# Altium schematic sheet LORA.SchDoc
size A4
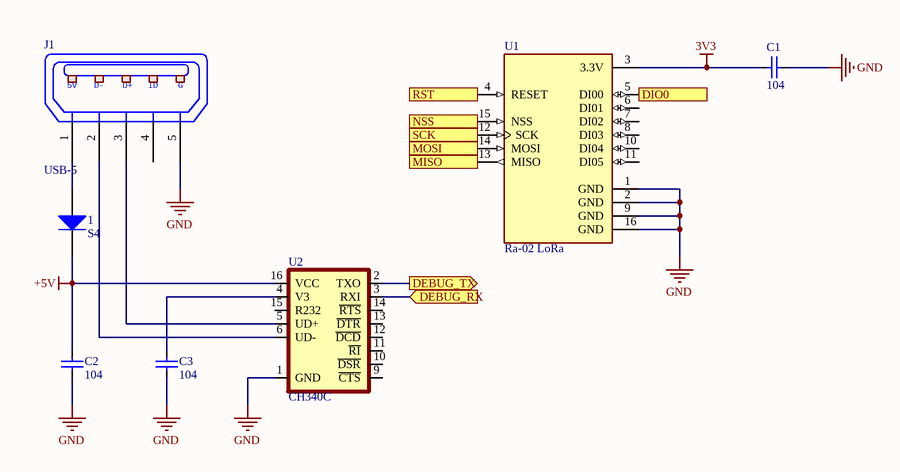
[diagram p0: LORA.SchDoc]

## Parts
1  S4  [DIO-214AC(SMA)]
C1  104  [CAP_0805]
C2  104  [CAP_0805]
C3  104  [CAP_0805]
J1  USB-5  [USB-M1]
U1  Ra-02 LoRa  [Ra-02]
U2  CH340C  [SOP-16]

## Ports
DEBUG_RX (in), DEBUG_TX (out), DIO0 (out), MISO (out), MOSI (in), NSS (in), RST (in), SCK (in)

## Nets
3V3: C1.2 U1.3(3.3V)
+5V: 1.2(K) C2.2 U2.16(VCC)
GND: C1.1 C2.1 C3.1 J1.5(P5) U1.1(GND) U1.2(GND) U1.9(GND) U1.16(GND) U2.1(GND)
DEBUG_RX: U2.3(RXI) ; port DEBUG_RX
DEBUG_TX: U2.2(TXO) ; port DEBUG_TX
DIO0: U1.5(DI00) ; port DIO0
MISO: U1.13(MISO) ; port MISO
MOSI: U1.14(MOSI) ; port MOSI
NSS: U1.15(NSS) ; port NSS
RST: U1.4(RESET) ; port RST
SCK: U1.12(SCK) ; port SCK
Net1_1: 1.1(A) J1.1(P1)
NetC3_2: C3.2 U2.4(V3)
NetJ1_2: J1.2(P2) U2.6(UD-)
NetJ1_3: J1.3(P3) U2.5(UD+)

Not connected (* = marked no-connect by the designer): J1 4(P4); U1 6(DI01) 7(DI02) 8(DI03) 10(DI04) 11(DI05); U2 9(~{CTS}) 10(~{DSR}) 11(~{RI}) 12(~{DCD}) 13(~{DTR}) 14(~{RTS}) 15(R232)

## Notes on the sheet
- (in symbol USB-5) 5V; D-; D+; ID; G

## Library data of the parts
1 = Diode S4: Dán; Ten_Linh_Kien: Diode S4 SOD123 ( 1N5819 SOD123); Ma_Hang: MH005519; Don_Vi: Con; Ghi_Chu: *; Chung_Loai: Dán; Kieu_Chan: *
C1-C3 = CapSMD: Capacitor; Value: 33p; Published: 8-Jun-2000; LatestRevisionDate: 17-Jul-2002; LatestRevisionNote: Re-released for DXP Platform.; PackageReference: RAD-0.3; Publisher: Altium Limited
J1 = USB-5: Manufacturer: FCI; Manufacturer Part Number: 10118193-0001LF; Connector Type: USB - micro B; Number of Contacts: 5; Gender: Receptacle; Specifications: USB 2.0; .Creator: MM; .Checked PCB: RF; Supplier 1: Digi-Key; RoHS: RoHS Compliant; Category: Connectors, Interconnects; Stock 1: 28642; Pricing 1: 1=0.46, 10=0.433, 25=0.3712, 50=0.3156, 100=0.3032, 250=0.27224, 500=0.25988 (USD); Packaging: Cut Tape (CT); Mounting Type: Surface Mount, Right Angle, Horizontal; Features: Shielded, Solder Retention; Ingress Protection: -; ComponentLink1URL: http://portal.fciconnect.com/Comergent//fci/drawing/10118193.pdf; ComponentLink1Description: http://portal.fciconnect.com/Comergent//fci/drawing/10118193.pdf; Supplier Part Number 1: 609-4616-1-ND; .Checked SCH: MM
U1 = Ra-02 LoRa: LoRa Module Ra-02
U2 = CH340C: USB to serial chip CH340; MF: WCH; Package: Package; Check_prices: https://www.snapeda.com/parts/CH340C/WCH/view-part/5428851/?ref=eda; Value: *; Price: None; MP: CH340C; Availability: Unavailable; SnapEDA_Link: https://www.snapeda.com/parts/CH340C/WCH/view-part/5428851/?ref=snap